# EAGLE design EEG-RM 151117P01 (EAGLE 7.6.0)
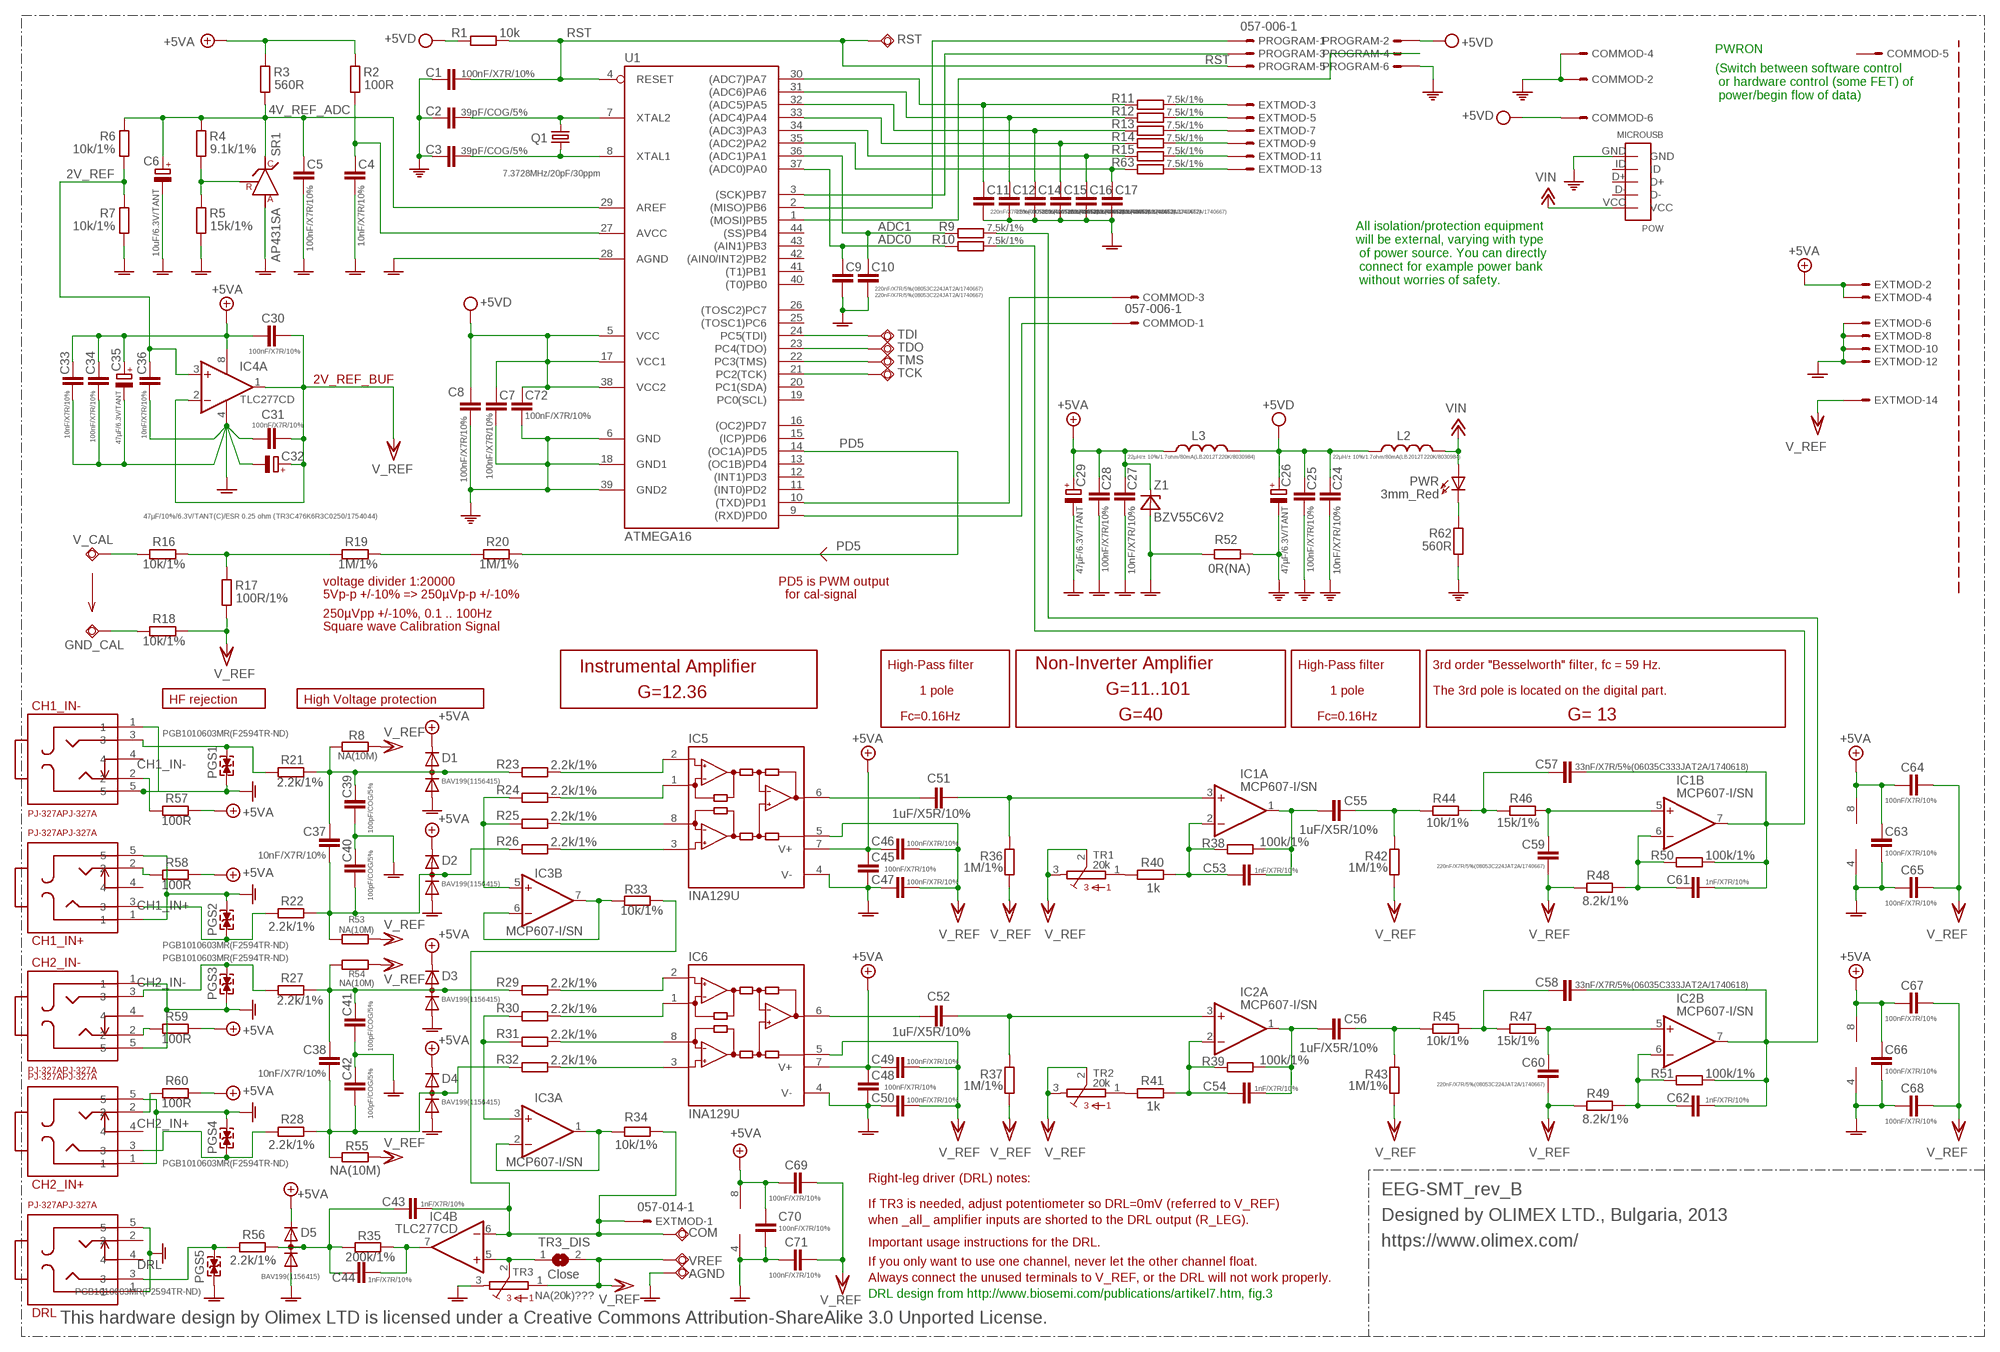
[diagram p0: schematic, sheet 1]

## Parts
AGND  TESTPAD3  [TEST_PAD40/70/SQUARE]
C1  100nF/X7R/10%  C-EUC2012  [C2012]
C2  39pF/COG/5%  C-EUC2012  [C2012]
C3  39pF/COG/5%  C-EUC2012  [C2012]
C4  10nF/X7R/10%  C-EUC2012  [C2012]
C5  100nF/X7R/10%  C-EUC2012  [C2012]
C6  10uF/6.3V/TANT  CPOL-EUCT3216  [CT3216]
C7  100nF/X7R/10%  C-EUC2012  [C2012]
C8  100nF/X7R/10%  C-EUC2012  [C2012]
C9  220nF/X7R/5%(08053C224JAT2A/1740667)  C-EUC2012  [C2012]
C10  220nF/X7R/5%(08053C224JAT2A/1740667)  C-EUC2012  [C2012]
C11  220nF/X7R/5%(08053C224JAT2A/1740667)  C-EUC2012  [C2012]
C12  220nF/X7R/5%(08053C224JAT2A/1740667)  C-EUC2012  [C2012]
C14  220nF/X7R/5%(08053C224JAT2A/1740667)  C-EUC2012  [C2012]
C15  220nF/X7R/5%(08053C224JAT2A/1740667)  C-EUC2012  [C2012]
C16  220nF/X7R/5%(08053C224JAT2A/1740667)  C-EUC2012  [C2012]
C17  220nF/X7R/5%(08053C224JAT2A/1740667)  C-EUC2012  [C2012]
C24  10nF/X7R/10%  C-EUC2012  [C2012]
C25  100nF/X7R/10%  C-EUC2012  [C2012]
C26  47µF/6.3V/TANT  CPOL-EUCT3528  [CT3528]
C27  10nF/X7R/10%  C-EUC2012  [C2012]
C28  100nF/X7R/10%  C-EUC2012  [C2012]
C29  47µF/6.3V/TANT  CPOL-EUCT3528  [CT3528]
C30  100nF/X7R/10%  C-EUC2012  [C2012]
C31  100nF/X7R/10%  C-EUC2012  [C2012]
C32  47µF/10%/6.3V/TANT(C)/ESR 0.25 ohm (TR3C476K6R3C0250/1754044)  CPOL-EUCT6032  [CT6032]
C33  10nF/X7R/10%  C-EUC2012  [C2012]
C34  100nF/X7R/10%  C-EUC2012  [C2012]
C35  47µF/6.3V/TANT  CPOL-EUCT3528  [CT3528]
C36  10nF/X7R/10%  C-EUC2012  [C2012]
C37  10nF/X7R/10%  C-EUC2012  [C2012]
C38  10nF/X7R/10%  C-EUC2012  [C2012]
C39  100pF/COG/5%  C-EUC2012  [C2012]
C40  100pF/COG/5%  C-EUC2012  [C2012]
C41  100pF/COG/5%  C-EUC2012  [C2012]
C42  100pF/COG/5%  C-EUC2012  [C2012]
C43  1nF/X7R/10%  C-EUC2012  [C2012]
C44  1nF/X7R/10%  C-EUC2012  [C2012]
C45  100nF/X7R/10%  C-EUC2012  [C2012]
C46  100nF/X7R/10%  C-EUC2012  [C2012]
C47  100nF/X7R/10%  C-EUC2012  [C2012]
C48  100nF/X7R/10%  C-EUC2012  [C2012]
C49  100nF/X7R/10%  C-EUC2012  [C2012]
C50  100nF/X7R/10%  C-EUC2012  [C2012]
C51  1uF/X5R/10%  C-EUC2012  [C2012]
C52  1uF/X5R/10%  C-EUC2012  [C2012]
C53  1nF/X7R/10%  C-EUC2012  [C2012]
C54  1nF/X7R/10%  C-EUC2012  [C2012]
C55  1uF/X5R/10%  C-EUC2012  [C2012]
C56  1uF/X5R/10%  C-EUC2012  [C2012]
C57  33nF/X7R/5%(06035C333JAT2A/1740618)  C-EUC2012  [C2012]
C58  33nF/X7R/5%(06035C333JAT2A/1740618)  C-EUC2012  [C2012]
C59  220nF/X7R/5%(08053C224JAT2A/1740667)  C-EUC2012  [C2012]
C60  220nF/X7R/5%(08053C224JAT2A/1740667)  C-EUC2012  [C2012]
C61  1nF/X7R/10%  C-EUC2012  [C2012]
C62  1nF/X7R/10%  C-EUC2012  [C2012]
C63  100nF/X7R/10%  C-EUC2012  [C2012]
C64  100nF/X7R/10%  C-EUC2012  [C2012]
C65  100nF/X7R/10%  C-EUC2012  [C2012]
C66  100nF/X7R/10%  C-EUC2012  [C2012]
C67  100nF/X7R/10%  C-EUC2012  [C2012]
C68  100nF/X7R/10%  C-EUC2012  [C2012]
C69  100nF/X7R/10%  C-EUC2012  [C2012]
C70  100nF/X7R/10%  C-EUC2012  [C2012]
C71  100nF/X7R/10%  C-EUC2012  [C2012]
C72  100nF/X7R/10%  C-EUC2012  [C2012]
CH1_IN+  PJ-327APJ-327A  [PJ-327A]
CH1_IN-  PJ-327APJ-327A  [PJ-327A]
CH2_IN+  PJ-327APJ-327A  [PJ-327A]
CH2_IN-  PJ-327APJ-327A  [PJ-327A]
COM  TESTPAD3  [TEST_PAD40/70/SQUARE]
COMMOD  057-006-1  [057-006-1]
D1  BAV199(1156415)  DIODE_AC-AC_  [SOT23C(BAT54S)]
D2  BAV199(1156415)  DIODE_AC-AC_  [SOT23C(BAT54S)]
D3  BAV199(1156415)  DIODE_AC-AC_  [SOT23C(BAT54S)]
D4  BAV199(1156415)  DIODE_AC-AC_  [SOT23C(BAT54S)]
D5  BAV199(1156415)  DIODE_AC-AC_  [SOT23C(BAT54S)]
DRL  PJ-327APJ-327A  [PJ-327A]
EXTMOD  057-014-1  [057-014-1]
GND_CAL  TESTPAD3  [TEST_PAD40/70/SQUARE]
IC1  MCP607-I/SN  LM358D  [SO08]
IC2  MCP607-I/SN  LM358D  [SO08]
IC3  MCP607-I/SN  LM358D  [SO08]
IC4  TLC277CD  LM358D  [SO08]
IC5  INA129U  [SO08]
IC6  INA129U  [SO08]
L2  22µH/± 10%/1.7ohm/80mA(LB2012T220K/8030984)  L-USL2012C  [L2012C]
L3  22µH/± 10%/1.7ohm/80mA(LB2012T220K/8030984)  L-USL2012C  [L2012C]
PGS1  PGB1010603MR(F2594TR-ND)  [0603]
PGS2  PGB1010603MR(F2594TR-ND)  [0603]
PGS3  PGB1010603MR(F2594TR-ND)  [0603]
PGS4  PGB1010603MR(F2594TR-ND)  [0603]
PGS5  PGB1010603MR(F2594TR-ND)  [0603]
POW  MICROUSB  [MICROUSB]
PROGRAM  057-006-1  [057-006-1]
PWR  3mm_Red  LED3.0MM  [LED-3.0MM]
Q1  7.3728MHz/20pF/30ppm  HC49/S1  [HC49/SMD2_THIN]
R1  10k  R-EU_M2012  [M2012]
R2  100R  R-EU_M2012  [M2012]
R3  560R  R-EU_M2012  [M2012]
R4  9.1k/1%  R-EU_M2012  [M2012]
R5  15k/1%  R-EU_M2012  [M2012]
R6  10k/1%  R-EU_M2012  [M2012]
R7  10k/1%  R-EU_M2012  [M2012]
R8  NA(10M)  R-EU_M2012  [M2012]
R9  7.5k/1%  R-EU_M2012  [M2012]
R10  7.5k/1%  R-EU_M2012  [M2012]
R11  7.5k/1%  R-EU_M2012  [M2012]
R12  7.5k/1%  R-EU_M2012  [M2012]
R13  7.5k/1%  R-EU_M2012  [M2012]
R14  7.5k/1%  R-EU_M2012  [M2012]
R15  7.5k/1%  R-EU_M2012  [M2012]
R16  10k/1%  R-EU_M2012  [M2012]
R17  100R/1%  R-EU_M2012  [M2012]
R18  10k/1%  R-EU_M2012  [M2012]
R19  1M/1%  R-EU_M2012  [M2012]
R20  1M/1%  R-EU_M2012  [M2012]
R21  2.2k/1%  R-EU_M2012  [M2012]
R22  2.2k/1%  R-EU_M2012  [M2012]
R23  2.2k/1%  R-EU_M2012  [M2012]
R24  2.2k/1%  R-EU_M2012  [M2012]
R25  2.2k/1%  R-EU_M2012  [M2012]
R26  2.2k/1%  R-EU_M2012  [M2012]
R27  2.2k/1%  R-EU_M2012  [M2012]
R28  2.2k/1%  R-EU_M2012  [M2012]
R29  2.2k/1%  R-EU_M2012  [M2012]
R30  2.2k/1%  R-EU_M2012  [M2012]
R31  2.2k/1%  R-EU_M2012  [M2012]
R32  2.2k/1%  R-EU_M2012  [M2012]
R33  10k/1%  R-EU_M2012  [M2012]
R34  10k/1%  R-EU_M2012  [M2012]
R35  200k/1%  R-EU_M2012  [M2012]
R36  1M/1%  R-EU_M2012  [M2012]
R37  1M/1%  R-EU_M2012  [M2012]
R38  100k/1%  R-EU_M2012  [M2012]
R39  100k/1%  R-EU_M2012  [M2012]
R40  1k  R-EU_M2012  [M2012]
R41  1k  R-EU_M2012  [M2012]
R42  1M/1%  R-EU_M2012  [M2012]
R43  1M/1%  R-EU_M2012  [M2012]
R44  10k/1%  R-EU_M2012  [M2012]
R45  10k/1%  R-EU_M2012  [M2012]
R46  15k/1%  R-EU_M2012  [M2012]
R47  15k/1%  R-EU_M2012  [M2012]
R48  8.2k/1%  R-EU_M2012  [M2012]
R49  8.2k/1%  R-EU_M2012  [M2012]
R50  100k/1%  R-EU_M2012  [M2012]
R51  100k/1%  R-EU_M2012  [M2012]
R52  0R(NA)  R-EU_M2012  [M2012]
R53  NA(10M)  R-EU_M2012  [M2012]
R54  NA(10M)  R-EU_M2012  [M2012]
R55  NA(10M)  R-EU_M2012  [M2012]
R56  2.2k/1%  R-EU_M2012  [M2012]
R57  100R  R-EU_M2012  [M2012]
R58  100R  R-EU_M2012  [M2012]
R59  100R  R-EU_M2012  [M2012]
R60  100R  R-EU_M2012  [M2012]
R62  560R  R-EU_M2012  [M2012]
R63  7.5k/1%  R-EU_M2012  [M2012]
RST  TESTPAD80/30  [SMD80/30]
SR1  AP431SA  TL431'''  [SOT-23]
TCK  TESTPAD80/30  [SMD80/30]
TDI  TESTPAD80/30  [SMD80/30]
TDO  TESTPAD80/30  [SMD80/30]
TMS  TESTPAD80/30  [SMD80/30]
TR1  20k  S64Y  [S64Y]
TR2  20k  S64Y  [S64Y]
TR3  NA(20k)???  S64Y  [S64Y]
TR3_DIS  Close  SJSJ_SMALLER  [SJ_1_SMALLER]
U1  ATMEGA16  [44TQFP]
V_CAL  TESTPAD3  [TEST_PAD40/70/SQUARE]
VREF  TESTPAD3  [TEST_PAD40/70/SQUARE]
Z1  BZV55C6V2  ZDIOD-SMD  [MINI-MELF]

## Nets
2V_REF: C36.1 IC4.3(A:+IN) R6.1 R7.2
4V_REF_ADC: C5.1 C6.+ R3.1 R4.2 R6.2 SR1.1(C) U1.29(AREF)
+5V: C27.1 C28.1 C29.+ C30.2 C33.1 C34.1 C35.+ C45.1 C46.1 C48.1 C49.1 C63.1 C64.1 C66.1 C67.1 C69.1 C70.1 D1.2(K) D2.2(K) D3.2(K) D4.2(K) D5.2(K) EXTMOD.2 EXTMOD.4 IC1.8(P:V+) IC2.8(P:V+) IC3.8(P:V+) IC4.8(P:V+) IC5.7(V+) IC6.7(V+) L3.2 R2.2 R3.2 R57.2 R58.2 R59.2 R60.2 Z1.1(C) ; supply symbol labelled +5VA
+12V: L2.1 POW.VCC PWR.A ; supply symbol labelled VIN
ADC0: C9.1 R10.1 U1.37((ADC0)PA0)
ADC1: C10.1 R9.1 U1.36((ADC1)PA1)
CH1_IN+: CH1_IN+.3 PGS2.1 R22.1
CH1_IN-: CH1_IN-.3 PGS1.2 R21.1
CH2_IN+: CH2_IN+.3 PGS4.1 R28.1
CH2_IN-: CH2_IN-.3 PGS3.2 R27.1
DRL: DRL.3 PGS5.2 R56.1
GNDA [pwr]: AGND.P$1(PP) C4.2 C5.2 C6.- C9.2 C10.2 C11.2 C12.2 C14.2 C15.2 C16.2 C17.2 C27.2 C28.2 C29.- C31.2 C32.- C33.2 C34.2 C35.- C36.2 C39.1 C40.2 C41.1 C42.2 C45.2 C47.1 C48.2 C50.1 C63.2 C65.1 C66.2 C68.1 C70.2 C71.1 CH1_IN+.1 CH1_IN+.5 CH1_IN-.1 CH1_IN-.5 CH2_IN+.1 CH2_IN+.5 CH2_IN-.1 CH2_IN-.5 D1.1(A) D2.1(A) D3.1(A) D4.1(A) D5.1(A) DRL.1 DRL.5 EXTMOD.6 EXTMOD.8 EXTMOD.10 EXTMOD.12 IC1.4(P:V-) IC2.4(P:V-) IC3.4(P:V-) IC4.4(P:V-) IC5.4(V-) IC6.4(V-) PGS1.1 PGS2.2 PGS3.1 PGS4.2 PGS5.1 R5.1 R7.1 R52.1 SR1.3(A) TR3.3 U1.28(AGND) Z1.2(A)
N$1: CH1_IN-.2 R57.1
N$2: CH1_IN+.2 R58.1
N$3: TDI.P$1(PP) U1.24(PC5(TDI))
N$4: TDO.P$1(PP) U1.23(PC4(TDO))
N$5: TMS.P$1(PP) U1.22(PC3(TMS))
N$6: TCK.P$1(PP) U1.21(PC2(TCK))
N$7: CH2_IN-.2 R59.1
N$9: C43.2 C44.2 D5.3(AK) R35.1 R56.2
N$10: CH2_IN+.2 R60.1
N$13: PROGRAM.1 U1.2((MISO)PB6)
N$14: PROGRAM.3 U1.3((SCK)PB7)
N$15: PWR.K(C) R62.2
N$16: PROGRAM.4 U1.1((MOSI)PB5)
N$17: EXTMOD.3 R11.2
N$18: C11.1 R11.1 U1.30((ADC7)PA7)
N$19: C12.1 R12.1 U1.31((ADC6)PA6)
N$20: EXTMOD.5 R12.2
N$21: C4.1 R2.1 U1.27(AVCC)
N$22: R4.1 R5.2 SR1.2(R)
N$23: COMMOD.3 U1.10((TXD)PD1)
N$24: COMMOD.1 U1.9((RXD)PD0)
N$25: C17.1 R63.1 U1.35((ADC2)PA2)
N$26: C16.1 R15.1 U1.34((ADC3)PA3)
N$27: C3.1 Q1.2 U1.8(XTAL1)
N$28: C2.1 Q1.1 U1.7(XTAL2)
N$29: R40.2 TR1.1
N$30: R41.2 TR2.1
N$31: EXTMOD.11 R15.2
N$32: EXTMOD.13 R63.2
N$33: EXTMOD.7 R13.2
N$34: EXTMOD.9 R14.2
N$35: C14.1 R13.1 U1.32((ADC5)PA5)
N$36: C15.1 R14.1 U1.33((ADC4)PA4)
N$81: C55.2 R42.1 R44.1
N$83: C51.1 IC5.6(OUT)
N$84: IC5.2(-IN) R23.1
N$88: IC5.1(RG) R24.1
N$92: C37.1 C40.1 D2.3(AK) R22.2 R26.2 R53.2
N$93: C37.2 C39.2 D1.3(AK) R8.2 R21.2 R23.2
N$94: C38.1 C42.1 D4.3(AK) R28.2 R32.2 R55.2
N$95: C38.2 C41.2 D3.3(AK) R27.2 R29.2 R54.2
N$101: IC5.8(RG) R25.1
N$102: C51.2 IC1.3(A:+IN) R36.1
N$103: IC3.5(B:+IN) R24.2 R25.2
N$104: C53.2 C55.1 IC1.1(A:OUT) R38.2
N$105: C53.1 IC1.2(A:-IN) R38.1 R40.1
N$106: IC5.3(+IN) R26.1
N$107: C59.1 IC1.5(B:+IN) R46.2
N$108: C57.1 R44.2 R46.1
N$109: C57.2 C61.2 IC1.7(B:OUT) R10.2 R50.2
N$110: C61.1 IC1.6(B:-IN) R48.1 R50.1
N$113: C52.2 IC2.3(A:+IN) R37.1
N$125: C54.2 C56.1 IC2.1(A:OUT) R39.2
N$126: C54.1 IC2.2(A:-IN) R39.1 R41.1
N$127: C60.1 IC2.5(B:+IN) R47.2
N$128: C58.1 R45.2 R47.1
N$129: C58.2 C62.2 IC2.7(B:OUT) R9.2 R51.2
N$130: C62.1 IC2.6(B:-IN) R49.1 R51.1
N$131: C56.2 R43.1 R45.1
N$133: C52.1 IC6.6(OUT)
N$134: IC6.1(RG) R30.1
N$135: IC6.8(RG) R31.1
N$136: IC3.3(A:+IN) R30.2 R31.2
N$137: IC6.2(-IN) R29.1
N$138: IC6.3(+IN) R32.1
N$139: IC3.1(A:OUT) IC3.2(A:-IN) R34.2
N$140: IC3.6(B:-IN) IC3.7(B:OUT) R33.2
N$141: IC4.5(B:+IN) TR3.2 TR3_DIS.1
N$142: C44.1 IC4.7(B:OUT) R35.2
N$144: R19.2 R20.1
N$145: C43.1 COM.P$1(PP) EXTMOD.1 IC4.6(B:-IN) R33.1 R34.1
N$146: R16.2 R17.2 R19.1
N$148: R16.1 V_CAL.P$1(PP)
N$149: GND_CAL.P$1(PP) R18.1
PD5: R20.2 U1.14((OC1A)PD5)
PE: C1.2 C2.2 C3.2 C7.2 C8.2 C24.2 C25.2 C26.- C72.2 COMMOD.2 COMMOD.4 POW.GND PROGRAM.6 R52.2 R62.1 U1.6(GND) U1.18(GND1) U1.39(GND2)
RST: C1.1 PROGRAM.5 R1.2 RST.P$1(PP) U1.4(RESET)
VCC/2: C30.1 C31.1 C32.+ C46.2 C47.2 C49.2 C50.2 C59.2 C60.2 C64.2 C65.2 C67.2 C68.2 C69.2 C71.2 EXTMOD.14 IC4.1(A:OUT) IC4.2(A:-IN) IC5.5(REF) IC6.5(REF) R8.1 R17.1 R18.2 R36.2 R37.2 R42.2 R43.2 R48.2 R49.2 R53.1 R54.1 R55.1 TR1.2 TR1.3 TR2.2 TR2.3 TR3.1 TR3_DIS.2 VREF.P$1(PP) ; supply symbol labelled V_REF
VPP: C7.1 C8.1 C24.1 C25.1 C26.+ C72.1 COMMOD.6 L2.2 L3.1 PROGRAM.2 R1.1 U1.5(VCC) U1.17(VCC1) U1.38(VCC2) ; supply symbol labelled +5VD
Unconnected: CH1_IN+.4 CH1_IN-.4 CH2_IN+.4 CH2_IN-.4 COMMOD.5 DRL.2 DRL.4 POW.D+ POW.D- POW.ID U1.11((INT0)PD2) U1.12((INT1)PD3) U1.13((OC1B)PD4) U1.15((ICP)PD6) U1.16((OC2)PD7) U1.19(PC0(SCL)) U1.20(PC1(SDA)) U1.25((TOSC1)PC6) U1.26((TOSC2)PC7) U1.40((T0)PB0) U1.41((T1)PB1) U1.42((AIN0/INT2)PB2) U1.43((AIN1)PB3) U1.44((SS)PB4)

## Notes on the sheet
- PWRON
- (Switch between software control
   or hardware control (some FET) of
   power/begin flow of data)
- All isolation/protection equipment 
  will be external, varying with type
   of power source. You can directly
   connect for example power bank
   without worries of safety.
- 2V_REF_BUF
- voltage divider 1:20000 | PD5 is PWM output
- 5Vp-p +/-10% => 250µVp-p +/-10% | for cal-signal
- 250µVpp +/-10%, 0.1 .. 100Hz
- Square wave Calibration Signal
- Instrumental Amplifier | High-Pass filter | Non-Inverter Amplifier | High-Pass filter | 3rd order "Besselworth" filter, fc = 59 Hz.
- HF rejection | High Voltage protection | G=12.36 | 1 pole | G=11..101 | 1 pole | The 3rd pole is located on the digital part.
- Fc=0.16Hz | G=40 | Fc=0.16Hz | G= 13
- Right-leg driver (DRL) notes:
- EEG-SMT_rev_B
- If TR3 is needed, adjust potentiometer so DRL=0mV (referred to V_REF)
- when _all_ amplifier inputs are shorted to the DRL output (R_LEG). | Designed by OLIMEX LTD., Bulgaria, 2013
- Important usage instructions for the DRL. | https://www.olimex.com/
- If you only want to use one channel, never let the other channel float.
- Always connect the unused terminals to V_REF, or the DRL will not work properly.
- DRL design from http://www.biosemi.com/publications/artikel7.htm, fig.3
- This hardware design by Olimex LTD is licensed under a Creative Commons Attribution-ShareAlike 3.0 Unported License.

## Library data of the parts
AGND COM GND_CAL RST TCK TDI TDO TMS V_CAL VREF = gogo:TESTPAD: drill 40mils, diameter 70mils
C1-C5 C7-C12 C14-C17 C24 C25 C27 C28 C30 C31 C33 C34 C36-C72 = rcl:C-EU: CAPACITOR, European symbol
C6 C26 C29 C32 C35 = rcl:CPOL-EU: POLARIZED CAPACITOR, European symbol
CH1_IN+ CH1_IN- CH2_IN+ CH2_IN- DRL = aud:PJ-327A
COMMOD PROGRAM = con-panduit:057-006-: CONNECTOR 6-pin series 057 contact pc board low profile headers; OC_FARNELL: unknown; OC_NEWARK: unknown
D1-D5 = semicon-smd-ipc:DIODE_AC-AC_: DUAL DIODE
EXTMOD = con-panduit:057-014-: CONNECTOR 10-pin series 057 contact pc board low profile headers; OC_FARNELL: unknown; OC_NEWARK: unknown
IC1-IC4 = linear:LM358: OP AMP
IC5 IC6 = burr-brown:INA129: Instrumentation Amplifiers Precision, Low Power; MF: TEXAS INSTRUMENTS; MPN: INA129U; OC_FARNELL: 1212415; OC_NEWARK: 35C1732
L2 L3 = rcl:L-US: INDUCTOR, American symbol
PGS1-PGS5 = OLIMEX_DISCRET:PGB1010603MR: PulseGuard® Suppressors Surface Mount Polymeric ESD Suppressors
POW = musb:MICROUSB
PWR = DOUBLE-SIDE:LED
Q1 = crystal:HC49/S: CRYSTAL
R1-R60 R62 R63 = rcl:R-EU_: RESISTOR, European symbol
SR1 = OLIMEX_IC:TL431: TL431 Programmable Shunt Regulator Features: -> Programmable Output Voltage to 36 Volts -> Low Dynamic Output Impedance 0.20 Typical -> Sink Current Capability of 1.0 to 100mA -> Equivalent Full-Range Temperature Coefficient of 50ppm/°C Typical -> Temperature Compensated For Operation Over Full Rated Operating Temperature Range -> Low Output Noise Voltage -> Fast Turn-on Response
TR1-TR3 = TRIMPOT:S64Y
TR3_DIS = jumper:SJ: SMD solder JUMPER
U1 = gogo:ATMEGA16
Z1 = gogo:ZDIOD-SMD

## Net classes
1 pwr: width 0.4 mm, clearance 0.23 mm

## Board
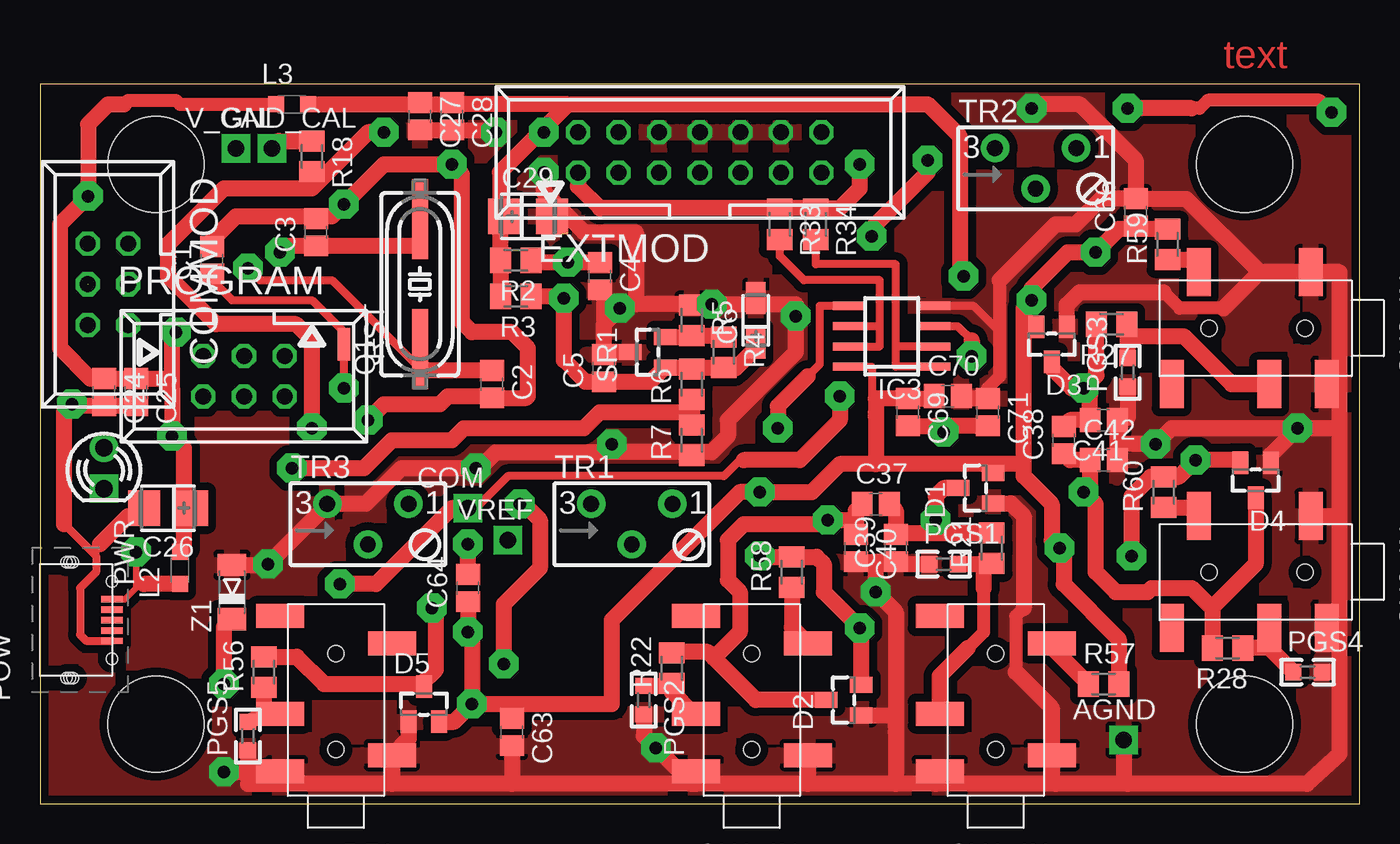
[diagram p1: board, top side]
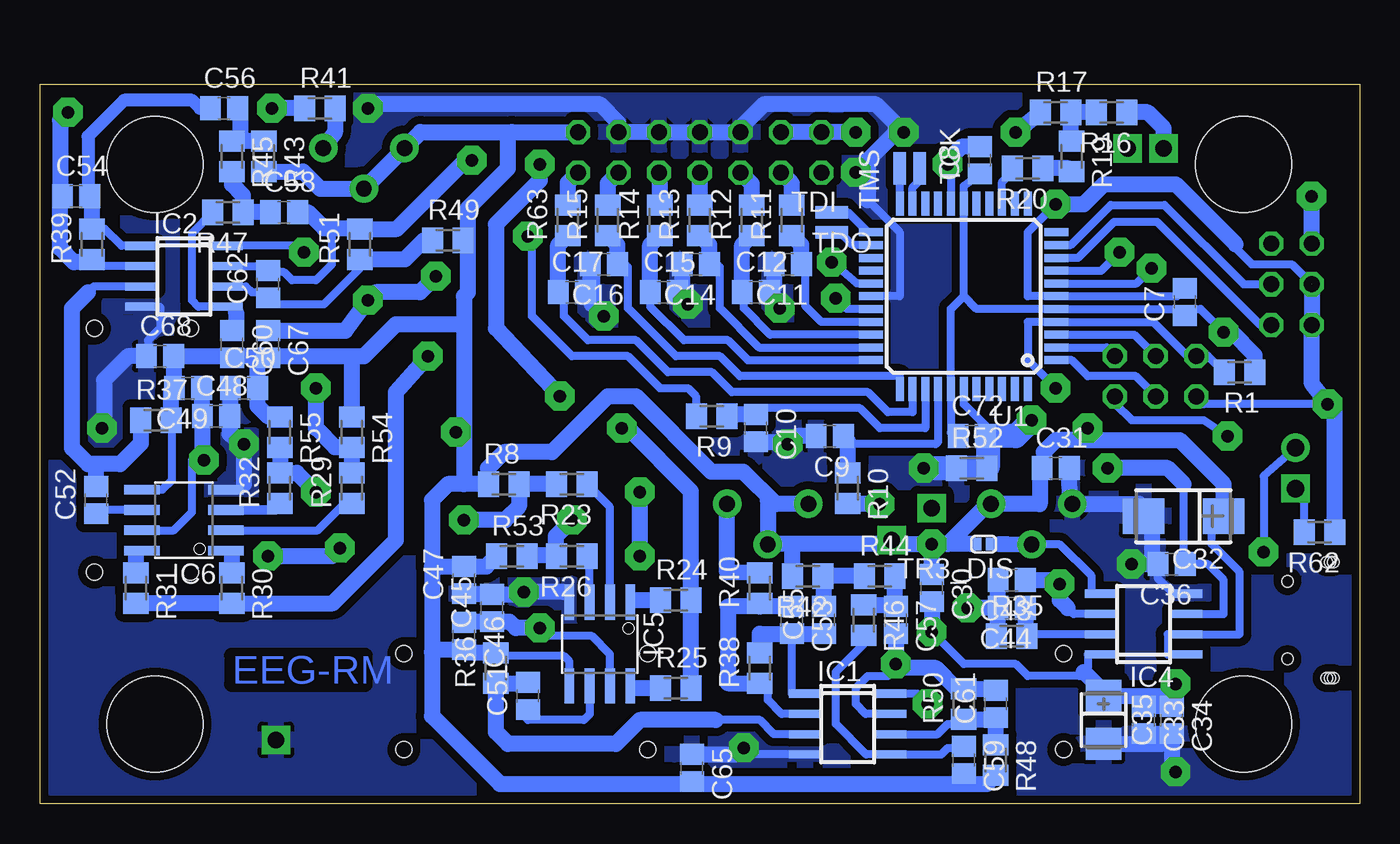
[diagram p2: board, bottom side, seen from below]

Size 82.5 x 45 mm. Coordinates in mm from the lower left corner, seen from the top.
Outline: 0,0 82.5,0 82.5,45 0,45 0,0
Copper layers (1*16): Top 0.035mm / dielectric 1.5mm / Bottom 0.035mm
Design rules "default *": minimum track width 10mil, minimum drill 24mil, track to track 0.5mm, track to pad 0.5mm, pad to pad 10mil, via to via 10mil, smd to smd 5mil, copper to edge 20mil, drill to drill 8mil, minimum pad ring 10mil, minimum via ring 20mil, stop-mask expansion 4mil, vias tented up to drill 0mil, thermal gap 10mil
Holes 6 mm at 75.31,5 7.24,5 7.24,40.01 75.31,40.01

### Footprints (pad centres in the part's own frame; a part is rotated, then mirrored left to right if it is on the bottom)
TEST_PAD40/70/SQUARE = drill 1.016 pad 1.778 square: P$1 0,0
C2012 = smd 1.3 x 1.5: 1 -0.85,0; 2 0.85,0
CT3216 = smd 2 x 1.2: + -1.4,0; - 1.4,0
CT3528 = smd 2 x 2.2: + -1.5,0; - 1.5,0
CT6032 = smd 2.6 x 2.2: + -2.5,0; - 2.5,0
PJ-327A = smd 3 x 1.5: 1 -3.5,3.45; 2 -3.5,-3.55; 3 3.5,0.85; 4 3.5,-5.25; 5 3.5,4.45 | hole 1: 0,3.1; 0,-2.9
057-006-1 = drill 1 octagon: 1 -2.54,-1.27; 2 -2.54,1.27; 3 0,-1.27; 4 0,1.27; 5 2.54,-1.27; 6 2.54,1.27
SOT23C(BAT54S) = smd 1 x 1.4: 1 -0.95,-1.1; 2 0.95,-1.1; 3 0,1.1
057-014-1 = drill 1 octagon: 1 -7.62,-1.27; 2 -7.62,1.27; 3 -5.08,-1.27; 4 -5.08,1.27; 5 -2.54,-1.27; 6 -2.54,1.27; 7 0,-1.27; 8 0,1.27; 9 2.54,-1.27; 10 2.54,1.27; 11 5.08,-1.27; 12 5.08,1.27; 13 7.62,-1.27; 14 7.62,1.27
SO08 = smd 0.508 x 2.032: 1 -1.905,-2.667; 2 -0.635,-2.667; 3 0.635,-2.667; 4 1.905,-2.667; 5 1.905,2.667; 6 0.635,2.667; 7 -0.635,2.667; 8 -1.905,2.667
SO08' = smd 0.61 x 2.21: 1 -1.905,-2.616; 2 -0.635,-2.616; 3 0.635,-2.616; 4 1.905,-2.616; 5 1.905,2.616; 6 0.635,2.616; 7 -0.635,2.616; 8 -1.905,2.616
L2012C = smd 1 x 1: 1 -1,0; 2 1,0
0603 = smd 1.016 x 1.016: 1 -0.889,0; 2 0.889,0
MICROUSB = smd 0.4 x 1.35: D+ 0,0; D- 0.65,0; GND -1.3,0; ID -0.65,0; VCC 1.3,0 | hole 0.7: -2.425,0; 2.425,0; -3.625,2.85; 3.625,2.85; -3.625,2.45; -3.625,2.65; 3.625,2.45; 3.625,2.65
LED-3.0MM = drill 1.092 pad 1.778: A -1.27,0 | drill 1.092 pad 1.778 square: K 1.27,0
HC49/SMD2_THIN = smd 5 x 1: 1 -4.064,0; 2 4.064,0
M2012 = smd 1.3 x 1.6: 1 -0.95,0; 2 0.95,0
SMD80/30 = smd 2.032 x 0.762: P$1 0,0
SOT-23 = smd 1 x 1.4: 1 -0.95,-1.1; 2 0.95,-1.1; 3 0,1.1
S64Y = drill 0.991 pad 1.778: 1 2.54,1.27; 2 0,-1.27; 3 -2.54,1.27
SJ_1_SMALLER = smd 0.508 x 0.762: 1 -0.381,0; 2 0.381,0
44TQFP = smd 1.5 x 0.5: 1 -5.8,4; 2 -5.8,3.2; 3 -5.8,2.4; 4 -5.8,1.6; 5 -5.8,0.8; 6 -5.8,0; 7 -5.8,-0.8; 8 -5.8,-1.6; 9 -5.8,-2.4; 10 -5.8,-3.2; 11 -5.8,-4; 23 5.8,-4; 24 5.8,-3.2; 25 5.8,-2.4; 26 5.8,-1.6; 27 5.8,-0.8; 28 5.8,0; 29 5.8,0.8; 30 5.8,1.6; 31 5.8,2.4; 32 5.8,3.2; 33 5.8,4 | smd 0.5 x 1.5: 12 -4,-5.8; 13 -3.2,-5.8; 14 -2.4,-5.8; 15 -1.6,-5.8; 16 -0.8,-5.8; 17 0,-5.8; 18 0.8,-5.8; 19 1.6,-5.8; 20 2.4,-5.8; 21 3.2,-5.8; 22 4,-5.8; 34 4,5.8; 35 3.2,5.8; 36 2.4,5.8; 37 1.6,5.8; 38 0.8,5.8; 39 0,5.8; 40 -0.8,5.8; 41 -1.6,5.8; 42 -2.4,5.8; 43 -3.2,5.8; 44 -4,5.8
MINI-MELF = smd 1.4 x 1.8: 1 -1.7,0; 2 1.7,0

### Placement (x,y rotation side)
AGND  67.75,4 0 top
C1  10.75,34 90 top
C2  28.25,26.25 270 top
C3  17.25,35.75 90 top
C4  35,33 270 top
C5  35.25,27.25 90 top
C6  44.75,30.25 90 top
C7  10.92,31.4 90 bottom
C8  23.75,40.25 90 bottom
C9  33.12,23 180 bottom
C10  37.75,23.5 270 bottom
C11  35.75,33.75 180 bottom
C12  37.75,32 0 bottom
C14  41.5,33.75 180 bottom
C15  43.5,32 0 bottom
C16  47.25,33.75 180 bottom
C17  49.25,32 0 bottom
C24  4,25.75 270 top
C25  6,25.75 270 top
C26  8,18.5 180 top
C27  23.75,43 270 top
C28  25.75,43 270 top
C29  30.5,36.75 0 top
C30  26.75,13.5 270 bottom
C31  19,21 0 bottom
C32  11,18 180 bottom
C33  13.5,5.25 270 bottom
C34  11.75,5.25 270 bottom
C35  16,5.25 270 bottom
C36  11.75,15 180 bottom
C37  52.25,18.75 0 top
C38  64,22.75 90 top
C39  53.5,16 90 top
C40  51,16 270 top
C41  66.5,24 180 top
C42  66.5,21.5 0 top
C43  21.75,14 180 bottom
C44  21.75,12.25 180 bottom
C45  54.25,12.25 90 bottom
C46  56,10.5 270 bottom
C47  56,14 90 bottom
C48  71.5,24.25 0 bottom
C49  73.25,26 180 bottom
C50  69.75,26 0 bottom
C51  52,6.75 90 bottom
C52  79,19 90 bottom
C53  35.5,11.5 270 bottom
C54  80.25,38 0 bottom
C55  33.5,11.5 90 bottom
C56  71,43.5 0 bottom
C57  29,11.5 270 bottom
C58  67.25,37 0 bottom
C59  24.75,2.75 270 bottom
C60  70.5,28.75 270 bottom
C61  22.75,6.25 90 bottom
C62  68.25,32.5 90 bottom
C63  29.5,4.5 270 top
C64  26.75,13.5 90 top
C65  41.75,2.25 270 bottom
C66  68.5,37 90 top
C67  68.25,28.75 270 bottom
C68  75,28 0 bottom
C69  54.25,24.5 270 top
C70  56.75,25.5 0 top
C71  59.25,24.5 270 top
C72  24.25,23 0 bottom
CH1_IN+  44.5,6.5 180 top
CH1_IN-  59.75,6.5 180 top
CH2_IN+  76,14.5 270 top
CH2_IN-  76,29.75 270 top
COM  26.75,18.5 0 top
COMMOD  4.25,32.5 90 top
D1  58.5,19.75 90 top
D2  50.25,6.5 90 top
D3  63.25,28.75 180 top
D4  76,20.25 180 top
D5  24,6.25 0 top
DRL  18.5,6.5 180 top
EXTMOD  41.25,40.75 0 top
GND_CAL  14.5,41 0 top
IC1  32,5 270 bottom
IC2  73.5,33 270 bottom
IC3  53.25,29.25 90 top
IC4  13.5,11.25 90 bottom
IC5  INA129U  [SO08']  47.5,10 180 bottom
IC6  INA129U  [SO08']  73.5,17.75 90 bottom
L2  8.75,14.75 90 top
L3  15.75,43.75 0 top
PGS1  56.5,15 0 top
PGS2  37.75,6.5 270 top
PGS3  68,27 90 top
PGS4  79.25,8.25 0 top
PGS5  13,4.25 90 top
POW  4.5,11.5 90 top
PROGRAM  12.75,26.75 180 top
PWR  4,21 270 top
Q1  23.75,32.5 90 top
R1  7.5,27 180 bottom
R2  29.75,34 180 top
R3  29.75,31.75 180 top
R4  42.75,28.25 270 top
R5  40.75,30.25 270 top
R6  40.75,26.25 90 top
R7  40.75,22.75 90 top
R8  53.5,20 0 bottom
R9  40.5,24.25 180 bottom
R10  32,19.75 270 bottom
R11  35.5,36.5 90 bottom
R12  38,36.5 90 bottom
R13  41.25,36.5 90 bottom
R14  43.75,36.5 90 bottom
R15  47,36.5 90 bottom
R16  15.5,43.25 180 bottom
R17  19,43.25 0 bottom
R18  17,40.5 270 top
R19  18,40.5 270 bottom
R20  20.75,39.75 180 bottom
R21  59.5,16 90 top
R22  39.5,8.5 90 top
R23  49.25,20 180 bottom
R24  42.75,12.75 0 bottom
R25  42.75,7.25 0 bottom
R26  49.25,15.5 180 bottom
R27  67,30 180 top
R28  74.25,9.75 180 top
R29  63,19.75 90 bottom
R30  70.5,13.5 270 bottom
R31  76.5,13.5 270 bottom
R32  67.5,19.75 90 bottom
R33  46.25,36.25 270 top
R34  48.5,36.25 270 top
R35  21.75,10.5 0 bottom
R36  54,8.5 90 bottom
R37  75.25,24 0 bottom
R38  37.5,8.5 90 bottom
R39  79.25,35 90 bottom
R40  37.5,13.5 90 bottom
R41  65,43.5 0 bottom
R42  34.5,14.25 180 bottom
R43  68.5,40.5 270 bottom
R44  30,14.25 0 bottom
R45  70.5,40.5 270 bottom
R46  31,11.5 270 bottom
R47  70.75,37 180 bottom
R48  22.75,2.75 270 bottom
R49  57,35.25 0 bottom
R50  24.75,6.25 90 bottom
R51  62.5,35 90 bottom
R52  24.25,21 0 bottom
R53  53,15.5 0 bottom
R54  63,23.25 270 bottom
R55  67.5,23.25 270 bottom
R56  14,8.25 90 top
R57  66.5,7.5 0 top
R58  47,14.5 90 top
R59  70.5,35 90 top
R60  70.25,19.5 90 top
R62  2.5,17 180 bottom
R63  49.5,36.5 90 bottom
RST  19,28.75 270 top
SR1  38,28.25 90 top
TCK  27.5,39.75 270 bottom
TDI  33,35.75 0 bottom
TDO  33,37 180 bottom
TMS  28.75,39.75 90 bottom
TR1  37,17.5 0 top
TR2  62.25,39.75 0 top
TR3  20.5,17.5 0 top
TR3_DIS  23.5,16.25 180 bottom
U1  24.75,31.75 180 bottom
V_CAL  12.25,41 0 top
VREF  29.25,16.5 0 top
Z1  12,13.25 90 top

### Tracks (layer width: path | path; a pad name or v marks a point on that pad's centre or on a via)
2V_REF  (via drill 0.8)
  Top 1: R6.1 40.75,24.5 | 40.75,24.5 R7.2 | v15.75,21 20.25,21 22,22.75 25.75,22.75 26.5,23.5 34,23.5 35,24.5 40.75,24.5
  Bottom 0.5: IC4.3 8.5,11.88 8.5,14 9.5,15 C36.1 11,15.1 11,20
  Bottom 1: 11,20 12,21 v15.75,21
4V_REF_ADC  (via drill 0.8)
  Top 1: 40.5,27.3 SR1.1 39.05,27.3 38.15,26.4 C5.1 34.1,26.4 32.75,27.75 v32.75,31.62 32.38,31.75 R3.1 | 40.5,27.3 R4.2 42.8,27.25 43.5,27.25 44.75,28.5 C6.+ | R6.2 40.6,27.2 40.5,27.3
  Bottom 0.5: U1.29 32.08,30.95 v32.75,31.62
+5V  (via drill 0.8)
  Top 0.5: IC3.8 52,27.34 52,24.5 52.25,24.25
  Top 1: v27,6.25 29.5,6.25 | 29.5,6.25 35.75,6.25 35.75,11.5 43.75,19.5 v45,19.5 48.25,19.5 50,21.25 52.25,21.25 | C63.1 29.5,6.25 | 51.45,10.8 v51.25,11 | 61.5,21.25 59.5,21.25 | 59.5,21.25 52.25,21.25 | 61.5,21.25 61.5,31 | 61.5,31 v62,31.5 62,32.25 64.25,34.5 v66,34.5 67.45,35.95 68.5,35.95 | v68.25,15.5 68.25,19.25 69.45,20.45 R60.2 71.2,20.45 v72.25,21.5 74.9,21.5 D4.2 | 61.5,21.25 61.5,20.5 63.25,18.75 63.25,16.5 v63.75,16 64,15.75 64,13.75 67.45,10.3 R57.2 | D1.2 59.6,21.15 59.5,21.25 | R59.2 68.5,35.95 | C66.1 68.5,35.95 | D3.2 61.65,29.85 61.5,31 | C70.1 55.75,25.35 C69.1 52.25,25.35 52.25,24.25 52.25,21.25 | D2.2 51.35,10.9 v51.25,11 | v45,15.5 45.05,15.45 R58.2 48.55,15.45 49,15 49,13.25 v51.25,11 | D5.2 25.9,5.15 v27,6.25 | v27,6.25 27,10.25 v26.75,10.75 C30.2 | R3.2 R2.2 28.75,34.05 28.75,36.5 | 31.5,42.25 28.75,39.5 28.75,36.5 | 31.5,42.25 v31.5,42 | 31.5,42.25 33,43.75 | 33,43.75 55.5,43.75 57.5,41.75 57.5,33.25 v57.75,33 | L3.2 24,43.75 | 24,43.75 25.65,43.75 C28.1 25.9,43.85 26,43.75 | 33,43.75 26,43.75 | 26,43.75 25.75,43.75 | C27.1 23.9,43.85 24,43.75 | C29.+ 28.75,36.5 | v11.5,7.5 11.5,11.05 Z1.1
  Bottom 0.5: v66,34.5 66.41,34.91 IC2.8 | IC1.8 27.66,6.91 v27,6.25 | v51.25,11 50.75,10.5 48,10.5 46.87,9.37 IC5.7 | IC6.7 74.14,17.11 73,18.25 73,21.5 v72.25,21.5
  Bottom 0.51: IC4.8 17,9.35 17,8.5 17.25,8.25 17.5,8 20.75,8 21.5,8.75 24.75,8.75 v26.75,10.75
  Bottom 1: C46.1 55.95,11.4 C45.1 53.15,11.4 52.75,11 v51.25,11 | v68.25,15.5 64.25,15.5 v63.75,16 | C49.1 72.4,24.3 C48.1 72.35,22.15 v72.25,21.5 | C67.1 63.4,29.6 v62,31.5 61.5,32 58.75,32 v57.75,33 | v45,15.5 v45,19.5 | C30.2 v26.75,10.75 | C33.1 C34.1 12.32,6.67 | 12.32,6.67 12.4,6.75 C35.+ 16,7 17.25,8.25 | v31.5,42 31.52,42.02 EXTMOD.2 EXTMOD.4 | v11.5,7.5 12.32,6.67
+12V  (via drill 0.8)
  Top 0.406: POW.VCC 5.3,12.8 6,13.5 6,14 | 6,14 v6,15.75 | 6.5,13.75 6.25,13.75 6,14
  Top 0.5: v6,15.75 6,16.25
  Top 1: L2.1 6.5,13.75
  Bottom 0.5: PWR.A 4,22.25 6,20.5 v6,15.75
ADC0
  Bottom 0.5: U1.37 26.35,22.65 26.5,22.5 31.77,22.5 C9.1
  Bottom 1: R10.1 32,22.73 C9.1
ADC1
  Bottom 0.5: U1.36 27.15,23.5 30,23.5 31.25,24.75 37.1,24.75 C10.1
  Bottom 1: C10.1 39.45,24.35 R9.1
CH1_IN+
  Top 1: PGS2.1 39.34,7.39 R22.1 39.5,7 40.85,5.65 CH1_IN+.3
CH1_IN-
  Top 0.8: 58,9.75 59,10.75 59,13.5
  Top 1: CH1_IN-.3 56.25,8 58,9.75 | PGS1.2 59,15 | 59,15 59.45,15 R21.1 | 59,13.5 59,15
CH2_IN+
  Top 1: PGS4.1 76.85,9.76 | 76.85,9.76 CH2_IN+.3 | 76.85,9.76 R28.1
CH2_IN-
  Top 1: 68,29.25 68,29.95 R27.1 | PGS3.2 68,29.25 | 68,29.25 71.5,29.25 74.5,26.25 CH2_IN-.3
DRL
  Top 1: DRL.3 14,5.65 | 14,5.65 R56.1 | PGS5.2 14,5.65
GNDA  (via drill 0.8)
  Top 0.5: IC3.4 58.34,31.16 60,29.5
  Top 0.8: 61.5,12.25 61,11.75 61,8.25 | 74,31 71.25,31 70.25,32 | C71.1 59.25,26 60,26.75 60,29.5 60,32.75
  Top 1: 68,1.25 79.22,1.25 81.25,3.15 81.25,8 | 68,1.25 63.5,1.25 | 63.5,1.25 56,1.25 | 56,1.25 53.5,1.25 | 53.5,1.25 48,1.25 | 48,1.25 41,1.25 | 40.75,1.25 29.5,1.25 | 29.5,1.25 22,1.25 | 22,1.25 15.44,1.25 | 15.44,1.25 DRL.5 14.95,2 v11.5,2 | CH1_IN+.5 41,1.25 | CH1_IN+.1 48,1.25 | CH1_IN-.5 56,1.25 | C40.2 52.25,15.15 | 52.25,15.15 C39.1 53.65,15 PGS1.1 | 53.5,4.5 53.5,12 v52.25,13.25 52.25,15.15 | 53.5,4.5 53.5,1.25 | D1.1 60.7,18.8 61.5,18 61.5,12.25 | 61,8.25 63.25,6 CH1_IN-.1 63.25,1.36 63.5,1.25 | 81.25,8 81.25,10.5 | 81.25,10.5 81.25,18 | 81.25,18 81.25,23.5 | 81.25,23.5 81.25,26.5 | 81.25,26.5 81.25,33.25 CH2_IN-.1 76.25,33.25 | CH2_IN-.5 80.45,26.5 81.25,26.5 | CH2_IN+.1 81.25,18 | CH2_IN+.5 80.75,11 81.25,10.5 | PGS4.2 81,8.25 81.25,8 | 67.35,22 C41.1 68,24.15 PGS3.1 | 67.35,22 C42.2 | 67.35,22 67.6,22.5 v69.75,22.5 70.75,23.5 v78.62,23.5 | v78.62,23.5 81.25,23.5 | C71.1 58,25.35 C70.2 | 60,32.75 63.5,36.25 64.75,36.25 66.35,37.85 C66.2 | 76.25,33.25 74,31 | C66.2 71.65,37.85 76.25,33.25 | C66.2 68.5,40.25 65,43.75 62.25,43.75 v62,43.5 | C63.2 29.5,1.25 | 22,1.25 DRL.1 23.05,4.1 D5.1 | D2.1 53.45,5.55 53.5,4.5 | 41,1.25 40.75,1.25 | 40.75,1.25 v38.5,3.5 37.75,4.25 PGS2.2 | D4.1 76.95,21.82 v78.62,23.5 | PGS5.1 13,1.25 15.44,1.25 | 42.5,31.25 v42,31.25 37.25,31.25 | 42.5,31.25 44.75,31.25 | 44.75,31.25 47.25,31.25 v47.25,30.5 47.25,28.25 43,24 43,23 42,22 40.5,22 | 37.25,31.25 v36.25,31 35.25,30 | 35.25,30 C5.2 35.65,28.25 SR1.3 | R5.1 42.45,31.2 42.5,31.25 | C6.- 44.75,31.25 | AGND.P$1 67.75,1.5 68,1.25 | R7.1 40.8,21.75 40.75,21.75 40.5,22 | D3.1 64.2,31.2 65,32 70.25,32 | v31.5,39.5 31.5,38.25 32.12,37.62 | C27.2 C28.2 28.35,42.15 v28.5,42
  Top 1: 32.12,37.62 34,35.75 37.25,35.75 37.25,31.25 | C4.2 35.25,32.15 35.25,30 | C29.- 32,37.5 32.12,37.62 | Z1.2 14.2,14.95 v14.25,15 18.02,18.77 20.37,18.77 22.6,21 v27.25,21 27.5,21 28.5,22 35.25,22 | 35.25,22 v35.75,22.5 | 40.5,22 35.25,22
  Bottom 0.5: IC5.4 49.41,13.25 49.75,13.25 | IC6.4 69.84,19.66 69.75,19.75 69.75,20 | IC1.4 38.59,3.1 v38.5,3.5 | IC2.4 75,31.09 75,29.75 75.75,29 75.75,28.1 C68.1 | IC4.4 11.65,13.15 12.6,14.1 C36.2 | 30.75,37.75 28.75,35.75 28.75,31.75 U1.28
  Bottom 1: C47.1 55.95,13.1 C45.2 52.4,13.1 v52.25,13.25 49.75,13.25 | C50.1 70.6,24.3 C48.2 70.65,23.15 v69.75,22.5 69.75,20 | C68.1 77,28 78.5,26.5 78.5,23.62 v78.62,23.5 | C65.1 38.9,3.1 v38.5,3.5 | C34.2 11.75,2.25 v11.5,2 | C33.2 C34.2 | C35.- 12.4,3.75 C34.2 | C31.2 18.12,18.77 TR3.3 13.77,18.77 13,18 C32.- 13,17.25 13,15 C36.2 v14.25,15 | C14.2 42.35,32.3 C15.2 42.65,31.65 v42,31.25 | C17.2 48.1,32.3 C16.2 48,33.65 48,31.25 v47.25,30.5 | 36.5,33.65 C11.2 36.6,32.3 C12.2 36.25,31.35 v36.25,31 | 30.75,40.25 29,42 | 29,42 29,42.5 30.25,43.75 37.25,43.75 38.5,42.5 38.5,42.23 EXTMOD.6 EXTMOD.8 EXTMOD.10 EXTMOD.12 46.33,42.58 47.5,43.75 61.75,43.75 v62,43.5 | 30.75,40.25 30.75,37.75 | v31.5,39.5 30.75,40.25 | 26.98,21.02 v27.25,21 | v28.5,42 29,42 | 25.75,21 25.25,21 R52.1 | C9.2 35.25,23 v35.75,22.5 35.9,22.65 C10.2
  Bottom 1.016: 52.16,13.22 v52.25,13.25
  Bottom 1.5: v27.25,21 25.75,21 | 23.5,21 25.25,21
  pour Bottom: 0,0 0,45 82.5,45 82.5,0
  pour Top: 0,0 82.5,0 82.5,45 0,45
N$1
  Top 1: R57.1 63.25,9.8 CH1_IN-.2
N$2
  Top 1: R58.1 47,11.05 CH1_IN+.2
N$3  (1 unrouted)
  Bottom 0.5: U1.24 31.7,34.95 32.25,35.5
N$4
  Bottom 0.5: U1.23 30.75,35.75 32,37 TDO.P$1
N$5
  Bottom 0.5: U1.22 TMS.P$1
N$6
  Bottom 0.5: U1.21 27.95,38.55 27.5,39 TCK.P$1
N$7
  Top 1: R59.1 71.9,34.05 CH2_IN-.2
N$9  (via drill 0.8)
  Top 1: R56.2 16.05,9.2 17.75,7.5 23.85,7.5 | 23.85,7.5 D5.3 | 23.85,7.5 24.75,8.4 24.75,12 v24.5,12.25
  Bottom 1: R35.1 22.6,10.6 C44.2 | C44.2 v24.5,12.25 | C44.2 C43.2
N$10
  Top 1: R60.1 71.9,18.55 CH2_IN+.2
N$13
  Bottom 0.5: U1.2 15.82,28.55 PROGRAM.1
N$14
  Bottom 0.5: U1.3 14.08,29.35 PROGRAM.3
N$15
  Bottom 0.5: R62.2 3.45,19.18 PWR.K
N$16
  Bottom 0.5: PROGRAM.4 12.75,25.5 14,26.75 17,26.75 18,27.75 U1.1
N$17
  Bottom 1: R11.2 35.5,38.81 EXTMOD.3
N$18
  Bottom 0.5: U1.30 33.65,30.15 34.65,31.15 34.65,33.5 C11.1
  Bottom 1: C11.1 34.9,34.95 R11.1
N$19
  Bottom 0.5: U1.31 36.85,29.35 38.5,31 38.5,31.65 C12.1
  Bottom 1: C12.1 38.6,34.95 R12.1
N$20
  Bottom 1: R12.2 38,38.77 EXTMOD.5
N$21  (via drill 0.8)
  Top 1: R2.1 30.82,33.88 v33,33.88 32.75,33.85 C4.1
  Bottom 0.5: U1.27 31.43,32.55 v33,33.88
N$22
  Top 1: SR1.2 40.6,29.2 R5.2 42.65,29.3 R4.1
N$23
  Bottom 0.5: COMMOD.3 7.25,32.5 12.2,37.45 15.55,37.45 18.05,34.95 U1.10
N$24
  Bottom 0.5: COMMOD.1 6.21,29.96 12.65,36.4 15.35,36.4 17.6,34.15 U1.9
N$25
  Bottom 0.5: U1.35 27.95,24.5 29.5,24.5 30.75,25.75 39.25,25.75 40.5,27 43.25,27 45.25,29 48.25,29 49.75,30.5 49.75,31.65 C17.1
  Bottom 1: C17.1 50.1,34.95 R63.1
N$26
  Bottom 0.5: U1.34 28.75,26.75 38.75,26.75 40,28 42.75,28 45.75,31 45.75,33.6 C16.1
  Bottom 1: C16.1 46.4,34.95 R15.1
N$27  (via drill 0.8)
  Top 1: v15,34.5 15.4,34.9 C3.1 23.75,34.9 Q1.2
  Bottom 0.5: U1.8 16.15,33.35 v15,34.5
N$28  (via drill 0.8)
  Top 0.5: v13,33.5 13.75,32.75 18.25,32.75 23.9,27.1 24,27.1
  Top 1: C2.1 24,27.1 23.75,27.1 Q1.1
  Bottom 0.5: U1.7 13.95,32.55 v13,33.5
N$29
  Bottom 1: R40.2 39.54,14.49 TR1.1
N$30
  Bottom 1: R41.2 64.05,42.01 TR2.1
N$31
  Bottom 1: R15.2 47,38.81 EXTMOD.11
N$32
  Bottom 1: R63.2 49.5,38.85 EXTMOD.13
N$33
  Bottom 1: R13.2 EXTMOD.7
N$34
  Bottom 1: R14.2 43.75,39.44 EXTMOD.9
N$35
  Bottom 0.5: U1.32 37.55,28.55 40,31 40,33.6 C14.1
  Bottom 1: C14.1 40.65,34.95 R13.1
N$36
  Bottom 0.5: C15.1 44.35,31.1 42.25,29 39.5,29 38.25,27.75 U1.33
  Bottom 1: C15.1 44.35,34.95 R14.1
N$81
  Bottom 1: R44.1 R42.1 33.5,13.25 C55.2
N$83
  Bottom 0.5: IC5.6 48.13,5.62 48.5,5.25 52,5.25 52.25,5.5 C51.1
N$84
  Bottom 0.5: IC5.2 46.87,18.57 R23.1
N$88
  Bottom 0.5: IC5.1 45.25,12.62 45.5,12.75 45.25,12.75
  Bottom 1: 45.25,12.75 R24.1
N$92  (via drill 0.8)
  Top 1: C37.1 51,18.35 51,17.5 | 51,17.5 C40.1 | D2.3 44.75,6.5 42.12,9.12 | 42.12,9.12 41.75,9.5 39.55,9.5 R22.2 | 42.12,9.12 43.75,10.75 43.75,13.25 43,14 43,16.5 44,17.5 49,17.5 v49.25,17.75 50.75,17.75 51,17.5
  Bottom 1: 50.25,15.55 R26.2 | 50.25,15.55 52,15.55 R53.2 | 50.25,15.55 50.25,16.75 v49.25,17.75
N$93  (via drill 0.8)
  Top 1: C37.2 53.5,18.35 C39.2 53.6,16.95 56,16.95 | 56,16.95 R21.2 | 56,16.95 v56,17.75 56,19.25 56.5,19.75 D1.3
  Bottom 1: R23.2 R8.2 52.55,18.62 53.42,17.75 v56,17.75
N$94  (via drill 0.8)
  Top 1: C38.1 64.4,21.5 C42.1 65.65,19.9 v65.25,19.5 66,18.75 66,14.5 67.25,13.25 69.25,13.25 69.5,13.5 72,13.5 73.25,12.25 | 73.25,12.25 73.3,12.2 R28.2 | D4.3 76,15 73.25,12.25
  Bottom 1: v65.25,19.5 66.45,20.7 R32.2 R55.2
N$95  (via drill 0.8)
  Top 1: C38.2 64.4,24 C41.2 65.65,25.6 v65.25,26 | 66.15,29.9 R27.2 66.05,26.8 v65.25,26 | D3.3 63.25,27.25 64.5,26 v65.25,26
  Bottom 1: R29.2 R54.2 64.05,22.3 65.25,23.5 v65.25,26
N$101
  Bottom 0.5: IC5.8 45.34,7 45.25,7.25
  Bottom 1: 45.25,7.25 R25.1
N$102
  Bottom 0.5: IC1.3 36.62,4.37 37.5,5.25 40.25,5.25
  Bottom 1: 40.25,5.25 45,5.25 46.5,3.75 53.25,3.75 54,4.5 R36.1 52.3,7.55 C51.2
N$103  (via drill 0.8)
  Top 0.5: 48,26.75 48.75,27.5 48.75,31.16 IC3.5
  Top 1: 48,26.75 46.12,24.88 v46.12,23.5
  Bottom 1: R25.2 R24.2 41.8,19.55 45.75,23.5 v46.12,23.5
N$104
  Bottom 0.5: IC1.1 35.5,6.91 C53.2
  Bottom 1: R38.2 37.5,10.65 C53.2 C55.1
N$105
  Bottom 0.5: IC1.2 36.13,5.63 37,6.5 37,7.55 R38.1
  Bottom 1: C53.1 37.5,12.35 | 37.5,12.35 39.5,12.35 39.5,7.55 R38.1 | R40.1 37.5,12.35
N$106
  Bottom 0.5: IC5.3 48.13,15.25 R26.1
N$107
  Bottom 0.5: C59.1 24.85,3.5 25.75,3.5 26.16,3.1 IC1.5 30.84,3.1 32.75,5 32.75,8.25 31,10 R46.2
N$108
  Bottom 1: R46.1 29.05,12.45 | 29.05,12.45 R44.2 | C57.1 29.05,12.35 29.05,12.45
N$109  (via drill 0.8)
  Top 1: v29,8.75 29,12.5 31.25,14.75 31.25,17.75 30.25,18.75 v30,18.75
  Bottom 0.5: IC1.7 30.89,5.63 31.5,6.25 31.5,7.25 30.75,8 29.5,8 29,8.5
  Bottom 1: C61.2 23.1,7.2 R50.2 25.2,7.2 26.5,8.5 29,8.5 v29,8.75 C57.2 | R10.2 30.3,18.8 v30,18.75
N$110
  Bottom 0.5: IC1.6 26.39,4.37 25.75,5 25.05,5 R50.1
  Bottom 1: R50.1 23.1,5.3 C61.1 | 22.9,5.3 C61.1 | R48.1 C61.1
N$113
  Bottom 0.5: IC2.3 79.14,32.37 79.5,32
  Bottom 1: R37.1 76.2,22.55 77.5,21.25 79,21.25 | 79,21.25 79.5,21.25 80.5,22.25 80.5,31 79.5,32 | C52.2 79,21.25
N$125
  Bottom 0.5: IC2.1 77.41,34.91 78.45,35.95 R39.2
  Bottom 0.8: 72,43.5 72.5,43.5 73,44 77.25,44 79.5,41.75 79.5,38.1 C54.2
  Bottom 1: R39.2 79.25,37.85 C54.2 | C56.1 72,43.5
N$126  (via drill 0.8)
  Top 0.8: v80.75,43.25 80,44 73,44 72.5,43.5 72,43.5
  Top 1: 72,43.5 v68,43.5
  Bottom 0.5: 79.75,33.88 R39.1 78.83,33.63 IC2.2
  Bottom 1: R41.1 v68,43.5 | 79.75,33.88 80.39,33.88 81.25,34.75 81.25,37.85 | 81.25,37.85 C54.1 | v80.75,43.25 81.25,42.75 81.25,37.85
N$127
  Bottom 0.5: 70.25,30.75 70.25,31 70.34,31.09 IC2.5 72.59,31.09 73,31.5 73,35.7 R47.2
  Bottom 1: 70.25,30.75 70.25,29.85 C60.1
N$128
  Bottom 1: C58.1 R47.1 69.8,38.05 70.5,38.75 R45.2
N$129  (via drill 0.8)
  Top 1: 55.5,40 v55.5,40.25 55.5,39.5 52,36 v52,35.5
  Bottom 0.5: IC2.7 68.78,33.63 C62.2 | C62.2 68.15,33 | C62.2 68.4,33.25 67.25,33.25 66.75,32.75 65.25,32.75 64.25,33.75 64.25,35.75 64,36 | v52,35.5 51.75,35 51.75,30.5 49.25,28 45.75,28 43.75,26 42,26 41.5,25.5 41.5,24.3 R9.2
  Bottom 1: C58.2 65.75,37 64.75,36 64,36 62.55,36 R51.2 60.2,35.95 55.9,40.25 v55.5,40.25
N$130
  Bottom 0.5: IC2.6 69.61,32.37 69.25,32 68.85,32 C62.1 68.4,31.65 68,31.25 64.75,31.25 62.5,33.5 R51.1
  Bottom 1: R49.1 58.5,35.25 59.7,34.05 R51.1
N$131
  Bottom 1: R43.1 70,41.45 | 70,41.45 R45.1 | C56.2 70,43.35 70,41.45
N$133
  Bottom 0.5: IC6.6 78.77,18.39 C52.1
N$134
  Bottom 0.5: 70.5,15.5 70.54,15.5 IC6.1
  Bottom 1: R30.1 70.5,15.5
N$135
  Bottom 0.5: 76.5,15.5 76.46,15.5 IC6.8
  Bottom 1: R31.1 76.5,15.5
N$136  (via drill 0.8)
  Top 0.5: IC3.3 57.37,29.89 58.25,29
  Top 1: 58.25,29 v58.25,28
  Bottom 1: R31.2 R30.2 64.2,12.55 60.25,16.5 60.25,25.75 v58.25,28
N$137
  Bottom 0.5: IC6.2 65.14,17.11 63.5,18.75 63.05,18.75 R29.1
N$138
  Bottom 0.61: IC6.3 67.79,18.41 R32.1
N$139
  Top 0.5: IC3.1 53.5,27.34 53.5,28.75 | 53.5,28.75 53.5,33.75 48.5,33.75 R34.2 | IC3.2 53.63,28.61 53.5,28.75
N$140
  Top 0.5: IC3.7 52.5,28.61 52.5,29.89 | IC3.6 52.5,29.89 | 52.5,29.89 52.5,32.75 47.75,32.75 46.25,34.25 R33.2
N$141
  Bottom 0.5: TR3_DIS.1 22.5,16.25 | IC4.5 16.75,13.15 16.75,14.25 18.73,16.23 TR3.2
  Bottom 1: 22.5,16.25 22.02,16.25 TR3.2
N$142
  Bottom 0.5: IC4.7 20.68,10.62 R35.2
  Bottom 1: C44.1 20.9,10.6 R35.2
N$144
  Bottom 1: R19.2 18.2,39.75 R20.1
N$145  (via drill 0.8)
  Top 0.5: 44,21.5 43.75,21.5 42.75,20.5 29.25,20.5 27.25,18.5 COM.P$1 | R33.1 46.05,37.2 46,37.25 | 48.55,37.2 R34.1
  Top 1: COM.P$1 25.75,18.5 21,13.75 v18.75,13.75 | 33.63,39.5 EXTMOD.1 33.63,38.62 35,37.25 46,37.25 48.5,37.25 | 48.55,37.2 48.5,37.25 | 48.5,37.25 50,37.25 51.25,38.5 v51.25,40 | v50,25.5 50,24 47.5,21.5 44,21.5
  Bottom 0.5: IC4.6 17.89,11.88 18.25,12.25
  Bottom 1: 18.25,12.25 18.75,12.75 v18.75,13.75 19,14 C43.1 | v50,25.5 54,29.75 54,36.25 51.25,39 v51.25,40
N$146
  Bottom 1: R16.2 R17.2 | 16.3,43.25 R17.2 | R19.1 18.05,41.5 R17.2
N$148
  Bottom 1: V_CAL.P$1 12.25,42.25 13.25,43.25 R16.1
N$149
  Top 1: GND_CAL.P$1 14.95,41.45 R18.1
PD5
  Bottom 0.5: U1.14 22.35,38.9 22,39.25 22.05,39.25 R20.2
PE  (via drill 0.8)  (1 unrouted)
  Top 0.406: 3.75,16.25 3.5,16 3.5,15
  Top 0.5: 1.5,17.5 3.5,15.5 3.5,15 3.5,14.5 2.5,13.5 2.5,10.58 2.88,10.2 POW.GND
  Top 1: 19.15,37.35 v19,37.5 | v19,37.5 21.5,40 v25.75,40 26.38,39.38 26.38,30.12 27,29.5 29.5,29.5 30.5,28.5 30.5,25.5 30.4,25.4 C2.2 28.15,25.5 25.5,25.5 25,25 21.5,25 v20.5,24 | 1.5,17.5 1.5,24.5 v2,25 2.1,24.9 C24.2 C25.2 | C26.- 6,18 5.5,18 3.75,16.25 | C1.2 10.75,35.25 12.25,36.75 17,36.75 | 17,36.75 18.25,36.75 v19,37.5 | C3.2 17.15,36.6 17,36.75
  Bottom 0.5: v19,37.5 20.75,35.75 20.75,31.75 U1.6 11.42,31.75 C7.2 | v25.75,40 25.55,39.95 U1.18 | 7.75,35 7.75,34.75 6.75,33.75 4.25,33.75 3,32.5 | v2,25 9.75,25 10.23,25.48 | PROGRAM.6 10.23,25.48 | 10.23,25.48 10.25,25.5 | C72.2 23.25,22.75 23.25,23.5 24.75,25 U1.39
  Bottom 1: COMMOD.4 COMMOD.2 2.98,26.27 v2,25 1.55,24.55 R62.1 | C8.2 24.9,41.1 25.75,40.25 v25.75,40 | v19,37.5 17.25,37.5 16,38.75 11.5,38.75 7.75,35 | 22.75,23 C72.2
  Bottom 1.5: v20.5,24 21.5,23 22.75,23 | 23.25,22.75 23.25,21.05 R52.2
RST  (via drill 0.8)
  Top 0.5: C1.1 10.75,32.75 12,31.5 17,31.5 19,29.5 RST.P$1 v19,26
  Bottom 0.5: PROGRAM.5 10.77,28.02 12.9,30.15 U1.4 20.75,30.15 20.75,27.75 v19,26 | 10.19,28 PROGRAM.5 | PROGRAM.5 9.47,28.02 R1.2
VCC/2  (via drill 0.8)
  Top 1: C69.2 56,23.65 | C71.2 56,23.65 | 56,23.65 v56.5,23.25 | C30.1 v26.75,16.25 | v21.5,42 20.5,42 17.25,38.75 | 17.25,38.75 17,38.5 11.5,38.5 8,35 8,33 11,30 16,30 17,29 v17,23.5 | R18.2 17,39 17.25,38.75
  Bottom 0.5: IC5.5 49.41,8.9 49.75,9.25 54.05,9.25 R36.2 | C65.2 41.5,1.25 | C59.2 24.75,1.25 | IC6.5 74.84,19.66 74.25,20.25 74.25,24.2 R37.2 | IC4.1 12,9.35 12,10.62 IC4.2 7.5,10.62 7.5,14.5 9.25,16.25 9.25,17.75 9.5,18 C32.+ 8.5,17.5 7.5,17.5 | TR3_DIS.2 24.25,16.25
  Bottom 1: 55.95,9.7 C46.2 | 58,14.85 C47.2 54.6,14.85 R53.1 | 58,14.85 58,9.5 | 58,9.5 58,5.5 53.75,1.25 41.5,1.25 24.75,1.25 23.3,1.25 R48.2 | C46.2 57.85,9.65 58,9.5 | R36.2 55.8,9.45 C46.2 | R37.2 74.3,25.8 C49.2 74.15,26.05 C68.2 70.5,28 | R55.1 68.2,24.2 68.9,24.9 C50.2 68.9,27.9 69,28 | 70.5,28 69,28 | 69,28 68.5,28 | 68.5,28 63,28 | 63,28 62.25,28 60.25,30 56,30 | C67.2 68.4,27.9 68.5,28 | C60.2 70.5,28 | R43.2 66.05,39.55 64.98,38.48 TR2.2 TR2.3 58.71,42.02 53,42.02 | 53,42.02 EXTMOD.14 | R54.1 63,28 | TR3.1 23.04,18.96 | C32.+ 8.5,20 11.25,22.75 17,22.75 | 24.25,16.25 25.75,16.25 | 25.75,16.25 v26.75,16.25 | C30.1 v26.75,16.25 | TR3.1 23.23,18.77 25.75,16.25 | 29.5,16.25 v26.75,16.25 | VREF.P$1 29.5,16.25 | 56,20 R8.1 54.5,20.05 54.5,21 53.5,22 50.5,22 47,25.5 45.25,25.5 40.54,20.79 38.54,20.79 36.5,18.75 37,19 | 56,20 57,20 58,19 58,14.85 | 56,30 56,23 | 56,23 56,20 | v56.5,23.25 56,23 | 55.75,35.25 55.75,32 56,31.75 56,30 | 55.75,35.25 55.75,37.25 53.25,39.75 53.25,41.77 53,42.02 | R49.2 55.75,35.25 | 29.5,16.25 35.5,16.25 | 35.5,16.25 36.98,16.25 TR1.2 37,19 | R42.2 35.45,16.2 35.5,16.25 | TR1.3 36.73,18.77 37,19 | R17.1 v21.5,42 | v17,23.5 17,22.75 | TR3.1 23.04,18.75 20,18.75 20,21 C31.1 19.75,21.1 19.75,22 19,22.75 17,22.75
VPP  (via drill 0.8)
  Top 0.8: 5.25,43.75 5.5,44 8.5,44 8.75,43.75 L3.1
  Top 1: 5.25,43.75 4.25,43.75 3,42.5 v3,38 1.25,36.25 1.25,28.5 3.15,26.6 C24.1 C25.1 7.65,26.6 8.25,26 | L2.2 9,16 9,17.5 9.5,18 C26.+ 9,19 9,22.25 v8.25,23 8.25,26 | 8.25,26 8.25,29.25 v8.5,29.5
  Bottom 0.5: 24.75,31.75 23.95,30.95 U1.5 10.5,30.95 | 24.75,31.75 U1.17 24.75,38.65 C8.1 | 24.75,31.75 25.55,30.95 U1.38 25.55,23.2 C72.1 | PROGRAM.2 15.29,25.04 14.25,24 9.75,24 v8.25,23 | 10.5,30.95 9.95,30.95 v8.5,29.5 | C7.1 10.67,30.78 10.5,30.95
  Bottom 1: COMMOD.6 2.98,37.98 v3,38 | R1.1 6.55,28.05 8,29.5 v8.5,29.5

### Text on the board
Top: text
Bottom: EEG-RM